# Altium schematic sheet MCU.SchDoc
size A4; SheetNumber: 5; SheetTotal: 5
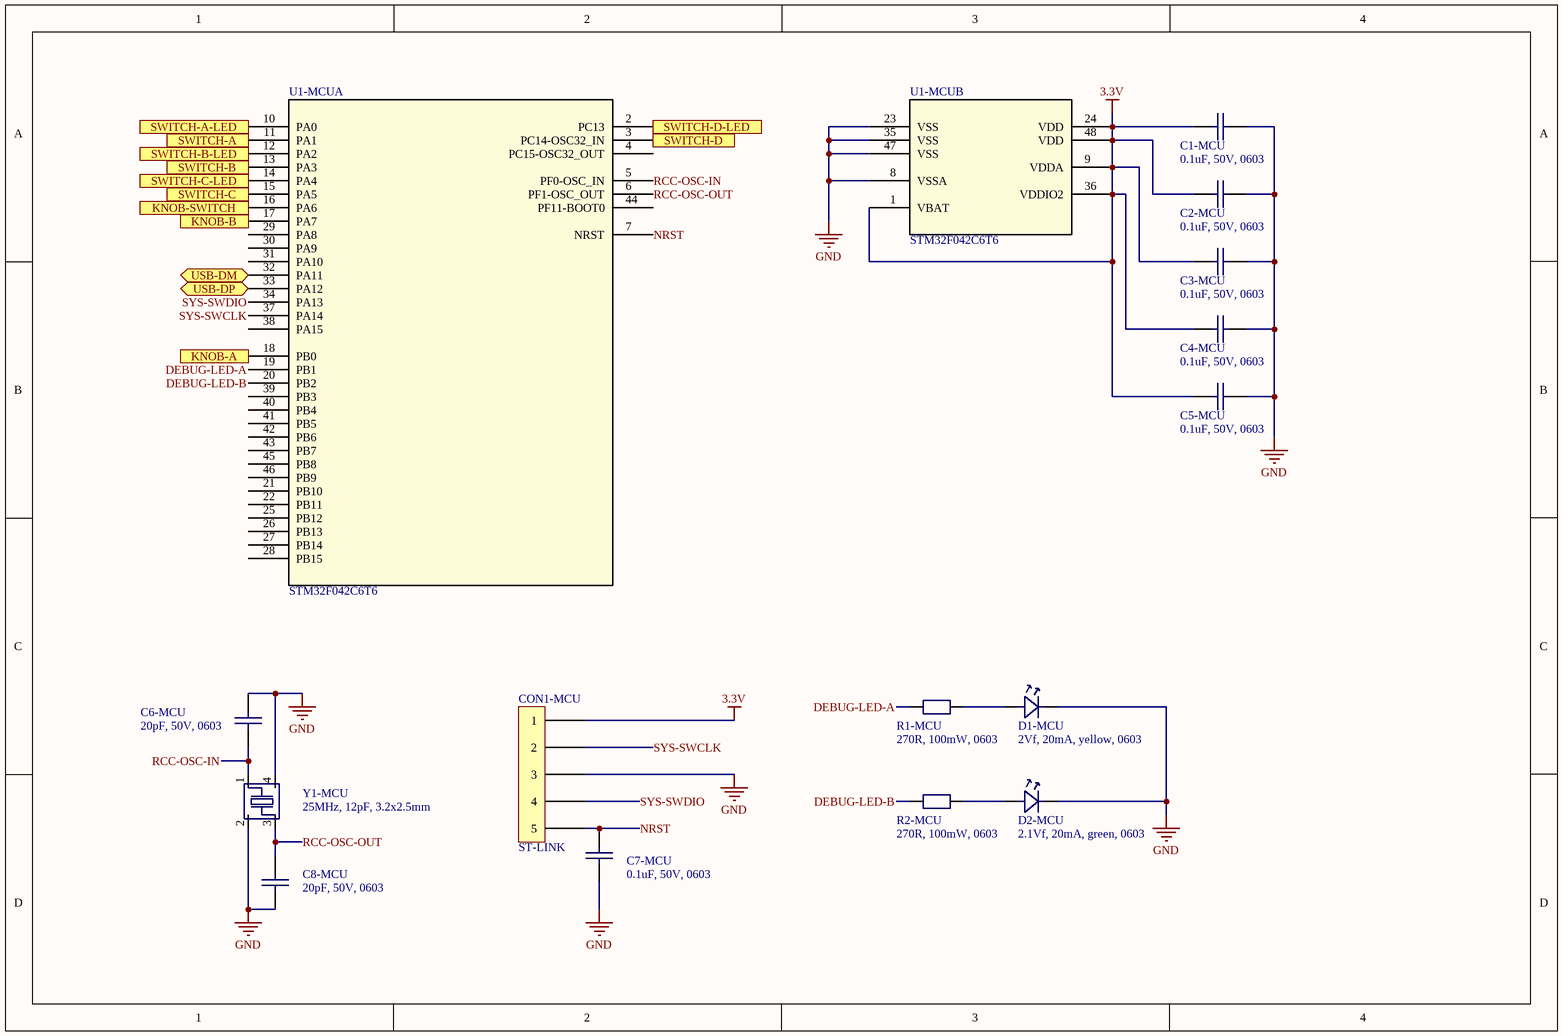
[diagram p0: MCU.SchDoc]

## Parts
C1-MCU  0.1uF, 50V, 0603  [0603 [1608]]
C2-MCU  0.1uF, 50V, 0603  [0603 [1608]]
C3-MCU  0.1uF, 50V, 0603  [0603 [1608]]
C4-MCU  0.1uF, 50V, 0603  [0603 [1608]]
C5-MCU  0.1uF, 50V, 0603  [0603 [1608]]
C6-MCU  20pF, 50V, 0603  [0603 [1608]]
C7-MCU  0.1uF, 50V, 0603  [0603 [1608]]
C8-MCU  20pF, 50V, 0603  [0603 [1608]]
CON1-MCU  ST-LINK  [5x1 Pin Header (TH)]
D1-MCU  2Vf, 20mA, yellow, 0603  [LED 0603 [1608]]
D2-MCU  2.1Vf, 20mA, green, 0603  [LED 0603 [1608]]
R1-MCU  270R, 100mW, 0603  [0603 [1608]]
R2-MCU  270R, 100mW, 0603  [0603 [1608]]
U1-MCU  STM32F042C6T6  [LQFP48]  (parts A,B of 2)
Y1-MCU  25MHz, 12pF, 3.2x2.5mm  [Crystal 3.2x2.5mm]

## Ports
KNOB-A (in, see OVERVIEW[1B], CONTROL-SWITCHES[3B]), KNOB-B (in, see OVERVIEW[1B], CONTROL-SWITCHES[3C]), KNOB-SWITCH (in, see OVERVIEW[1B], CONTROL-SWITCHES[3D]), SWITCH-A (in, see OVERVIEW[1B], CONTROL-SWITCHES[1A]), SWITCH-A-LED (out, see OVERVIEW[2B], CONTROL-SWITCHES[1B]), SWITCH-B (in, see OVERVIEW[1B], CONTROL-SWITCHES[1B]), SWITCH-B-LED (out, see OVERVIEW[2B], CONTROL-SWITCHES[1C]), SWITCH-C (in, see OVERVIEW[1B], CONTROL-SWITCHES[1C]), SWITCH-C-LED (out, see OVERVIEW[2B], CONTROL-SWITCHES[1D]), SWITCH-D (in, see OVERVIEW[1B], CONTROL-SWITCHES[3A]), SWITCH-D-LED (out, see OVERVIEW[2B], CONTROL-SWITCHES[3B]), USB-DM (bidir, see OVERVIEW[1B], USB-PORT[1C]), USB-DP (bidir, see OVERVIEW[1B], USB-PORT[1C])

## Nets
3.3V: C1-MCU.1 C2-MCU.1 C3-MCU.1 C4-MCU.1 C5-MCU.1 CON1-MCU.1 U1-MCU.1(VBAT) U1-MCU.9(VDDA) U1-MCU.24(VDD) U1-MCU.36(VDDIO2) U1-MCU.48(VDD)
GND: C1-MCU.2 C2-MCU.2 C3-MCU.2 C4-MCU.2 C5-MCU.2 C6-MCU.1 C7-MCU.2 C8-MCU.2 CON1-MCU.3 D1-MCU.1 D2-MCU.1 U1-MCU.8(VSSA) U1-MCU.23(VSS) U1-MCU.35(VSS) U1-MCU.47(VSS) Y1-MCU.2 Y1-MCU.4
DEBUG-LED-A: R1-MCU.2 U1-MCU.19(PB1)
DEBUG-LED-B: R2-MCU.2 U1-MCU.20(PB2)
KNOB-A: U1-MCU.18(PB0) ; port KNOB-A
KNOB-B: U1-MCU.17(PA7) ; port KNOB-B
KNOB-SWITCH: U1-MCU.16(PA6) ; port KNOB-SWITCH
NRST: C7-MCU.1 CON1-MCU.5 U1-MCU.7(NRST)
RCC-OSC-IN: C6-MCU.2 U1-MCU.5(PF0-OSC_IN) Y1-MCU.1
RCC-OSC-OUT: C8-MCU.1 U1-MCU.6(PF1-OSC_OUT) Y1-MCU.3
SWITCH-A: U1-MCU.11(PA1) ; port SWITCH-A
SWITCH-A-LED: U1-MCU.10(PA0) ; port SWITCH-A-LED
SWITCH-B: U1-MCU.13(PA3) ; port SWITCH-B
SWITCH-B-LED: U1-MCU.12(PA2) ; port SWITCH-B-LED
SWITCH-C: U1-MCU.15(PA5) ; port SWITCH-C
SWITCH-C-LED: U1-MCU.14(PA4) ; port SWITCH-C-LED
SWITCH-D: U1-MCU.3(PC14-OSC32_IN) ; port SWITCH-D
SWITCH-D-LED: U1-MCU.2(PC13) ; port SWITCH-D-LED
SYS-SWCLK: CON1-MCU.2 U1-MCU.37(PA14)
SYS-SWDIO: CON1-MCU.4 U1-MCU.34(PA13)
USB-DM: U1-MCU.32(PA11) ; port USB-DM
USB-DP: U1-MCU.33(PA12) ; port USB-DP
NetD1-MCU_2: D1-MCU.2 R1-MCU.1
NetD2-MCU_2: D2-MCU.2 R2-MCU.1

Not connected (* = marked no-connect by the designer): U1-MCU 4(PC15-OSC32_OUT) 21(PB10) 22(PB11) 25(PB12) 26(PB13) 27(PB14) 28(PB15) 29(PA8) 30(PA9) 31(PA10) 38(PA15) 39(PB3) 40(PB4) 41(PB5) 42(PB6) 43(PB7) 44(PF11-BOOT0) 45(PB8) 46(PB9)

## Library data of the parts
C1-MCU C2-MCU C3-MCU C4-MCU C5-MCU C7-MCU = Capacitor: Manufacturer: MULTICOMP PRO; Manufacturer ID: MC0603B104J500CT; Supplier: Farnell; Supplier ID: 2320803; URL: https://ee.farnell.com/multicomp/mc0603b104j500ct/cap-0-1-f-50v-5-x7r-0603/dp/2320803?st=100%20nf
C6-MCU C8-MCU = Capacitor: Manufacturer: MULTICOMP PRO; Manufacturer ID: MC0603N200J500CT; Supplier: Farnell; Supplier ID: 2627461; URL: https://ee.farnell.com/multicomp/mc0603n200j500ct/cap-20pf-50v-5-c0g-np0-0603/dp/2627461
CON1-MCU = 5x1 Pin Header: Manufacturer: AMPHENOL; Manufacturer ID: 68000-105HLF; Supplier: Farnell; Supplier ID: 2751380; URL: https://ee.farnell.com/amphenol-icc-fci/68000-105hlf/connector-header-5pos-1row-2-54mm/dp/2751380
D1-MCU = LED: Manufacturer: KINGBRIGHT; Manufacturer ID: KP-1608SYC; Supplier: Farnell; Supplier ID: 8529841; URL: https://ee.farnell.com/kingbright/kp-1608syc/led-0-8mm-x-1-2mm-yellow-80mcd/dp/8529841
D2-MCU = LED: Manufacturer: KINGBRIGHT; Manufacturer ID: KP-1608CGCK; Supplier: Farnell; Supplier ID: 2290328; URL: https://ee.farnell.com/kingbright/kp-1608cgck/led-0603-50mcd-green/dp/2290328
R1-MCU R2-MCU = Resistor: Manufacturer: YAGEO; Manufacturer ID: RC0603FR-07270RL; Supplier: Farnell; Supplier ID: 9238417; URL: https://ee.farnell.com/yageo/rc0603fr-07270rl/res-270r-1-0-1w-0603-thick-film/dp/9238417
U1-MCU = STM32F042C6T6 (MCU): Manufacturer: STMicroelectronics; Manufacturer ID: STM32F042C6T6; Supplier: JLCPCB; Supplier ID: C88447; URL: https://jlcpcb.com/partdetail/Stmicroelectronics-STM32F042C6T6/C88447
Y1-MCU = Crystal 4-pin: Manufacturer: MULTICOMP PRO; Manufacturer ID: MCSJK-7U-25.00-12-10-60-B-10; Supplier: Farnell; Supplier ID: 2853968; URL: https://ee.farnell.com/multicomp/mcsjk-7u-25-00-12-10-60-b-10/crystal-25mhz-12pf-3-2mm-x-2-5mm/dp/2853968?st=mcsjk-7u-25.00-12-10-60-b-10